# EasyEDA Pro project compSensorMB.eprj

# Schematic Schematic1
Create Date: 2024-01-20; Page Name: P1; Project Name: compSensorMB; Schematic Name: Schematic1; Update Date: 2024-04-05; Company: 嘉立创EDA; Page Size: A4; Version: V1.0
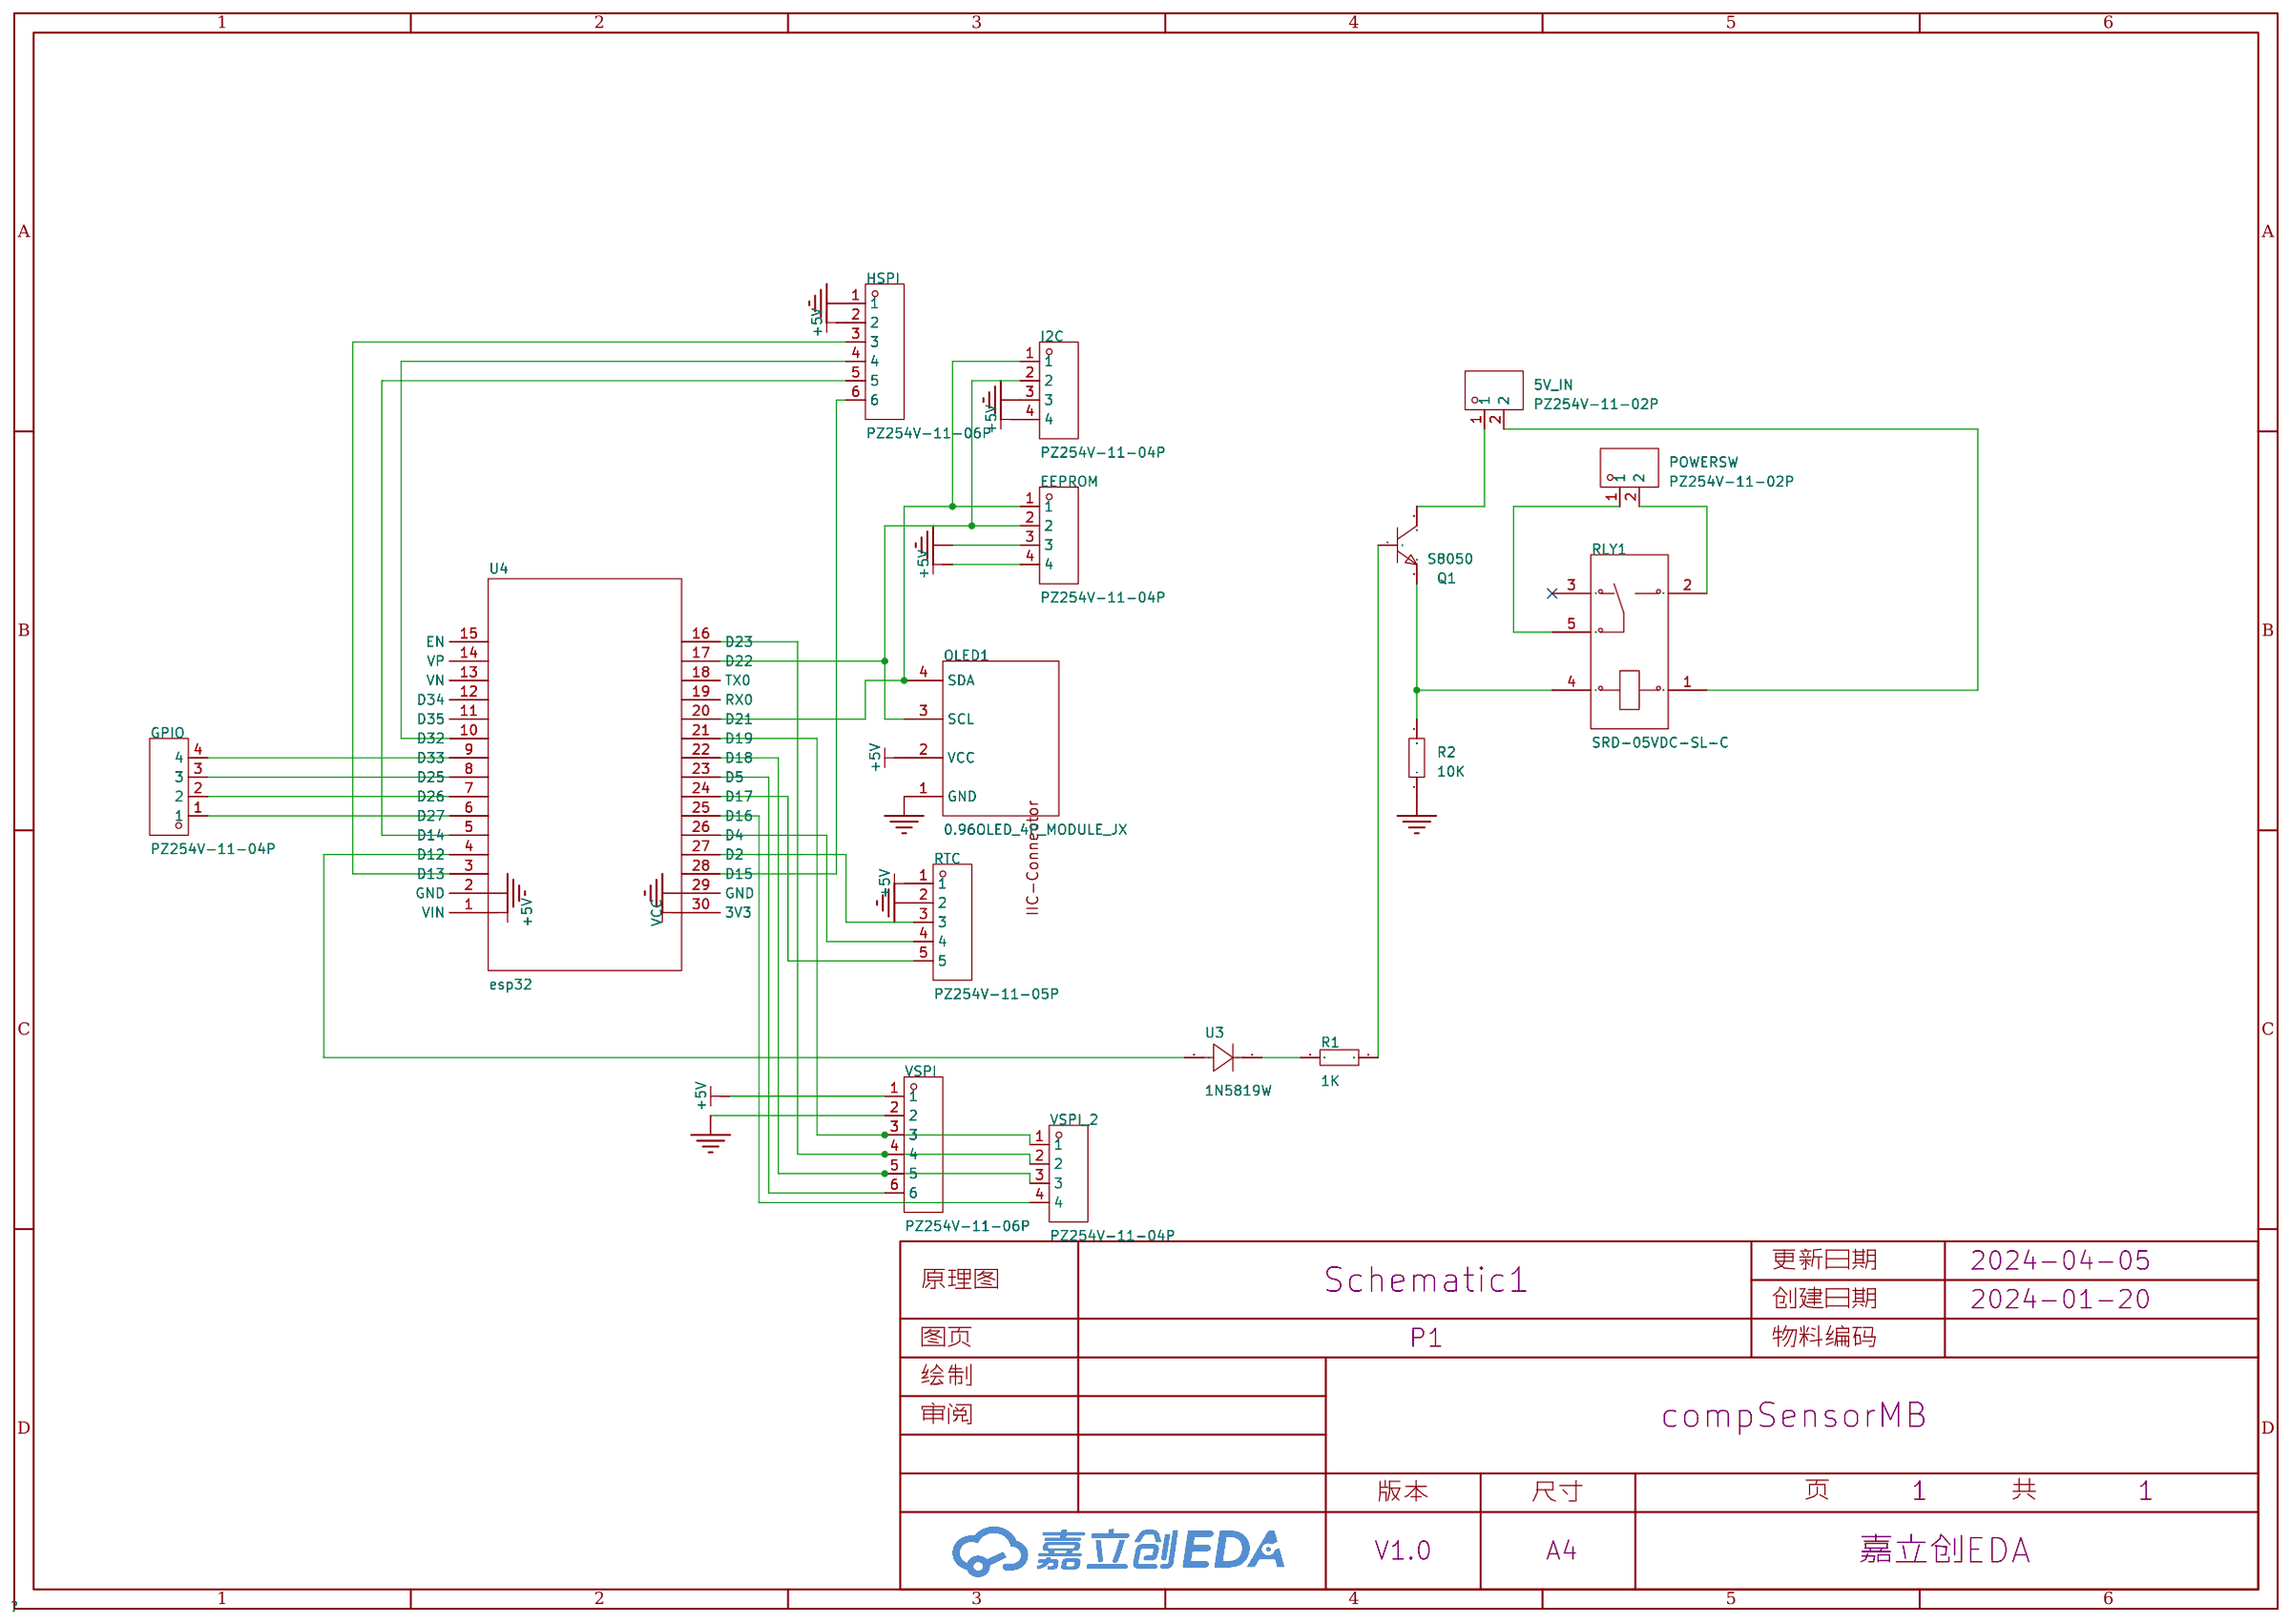
[diagram p0: schematic sheet]

## Parts
5V_IN  PZ254V-11-02P  [HDR-TH_2P-P2.54-V-M]
EEPROM  PZ254V-11-04P  [HDR-TH_4P-P2.54-V-M]
GPIO  PZ254V-11-04P  [HDR-TH_4P-P2.54-V-M]
HSPI  PZ254V-11-06P  [HDR-TH_6P-P2.54-V-M]
I2C  PZ254V-11-04P  [HDR-TH_4P-P2.54-V-M]
OLED1  0.96OLED_4P_MODULE_JX  [0.96OLED_4P]
POWERSW  PZ254V-11-02P  [HDR-TH_2P-P2.54-V-M]
Q1  S8050  [SOT-23-3_L2.9-W1.3-P1.90-LS2.4-BR]
R1  1K  [R0603]
R2  10K  [R0603]
RLY1  SRD-05VDC-SL-C  [RELAY-TH_SRD-XXVDC-XL-C]
RTC  PZ254V-11-05P  [HDR-TH_5P-P2.54-V-M]
U3  1N5819W  [SOD-123_L2.7-W1.6-LS3.7-R-RD]
U4  esp32  [esp32]
VSPI  PZ254V-11-06P  [HDR-TH_6P-P2.54-V-M]
VSPI_2  PZ254V-11-04P  [HDR-TH_4P-P2.54-V-M]

## Library data of the parts
5V_IN POWERSW = PZ254V-11-02P: 插针结构:1x2P;间距:2.54mm;行距:-;圆针/方针:方针;安装类型:直插;排数:单排;总PIN位数:2P;额定电流:-;额定电压:-;配合针长度:6mm;塑高:2.5mm;端接针长度:3mm;触头材质:黄铜;触头镀层:-;工作温度范围:-40℃~+105℃;颜色:黑色;; LCSC Part Name: 间距:2.54mm 1x2P 直插 方针; Supplier Part: C492401; Manufacturer: XFCN(兴飞); Supplier Footprint: 插件,P=2.54mm; JLCPCB Part Class: 扩展库; Datasheet: https://atta.szlcsc.com/upload/public/pdf/source/20200309/C492401_A812433581A9B211A7FFA413ADDFF0E5.pdf; Supplier: LCSC; Pin Structure: 1x2P; Pitch: 2.54mm; Circluar Pins/Square Pins: 方针; Mounting Type: 直插; Number of Rows: 单排; Number of Pins: 2P; Length of Mating Pin: 6mm; Insulation Height: 2.5mm; Length of End Connection Pin: 3mm; Contact Material: 黄铜; Operating Temperature Range: -40℃~+105℃; Color: 黑色
EEPROM GPIO I2C VSPI_2 = PZ254V-11-04P: 插针结构:1x4P;间距:2.54mm;行距:-;圆针/方针:方针;安装类型:直插;排数:单排;总PIN位数:4P;额定电流:3A;额定电压:250V;配合针长度:6mm;塑高:2.5mm;端接针长度:3mm;触头材质:-;工作温度范围:-40℃~+105℃;颜色:黑色;; LCSC Part Name: 间距:2.54mm 1x4P 直插 方针; Supplier Part: C2691448; Manufacturer: XFCN(兴飞); Supplier Footprint: 插件,P=2.54mm; JLCPCB Part Class: 扩展库; Datasheet: https://atta.szlcsc.com/upload/public/pdf/source/20200309/C492403_F9F19131791D08044AD4F84F8E751A34.pdf; Supplier: LCSC; Pin Structure: 1x4P; Pitch: 2.54mm; Circluar Pins/Square Pins: 方针; Mounting Type: 直插; Number of Rows: 单排; Number of Pins: 4P; Current Rating (Max): 3A; Voltage Rating (Max): 250V; Length of Mating Pin: 6mm; Insulation Height: 2.5mm; Length of End Connection Pin: 3mm; Operating Temperature Range: -40℃~+105℃; Color: 黑色
HSPI VSPI = PZ254V-11-06P: 插针结构:1x6P;间距:2.54mm;行距:-;圆针/方针:方针;安装类型:直插;排数:单排;总PIN位数:6P;额定电流:-;额定电压:-;配合针长度:6mm;塑高:2.5mm;端接针长度:3mm;触头材质:黄铜;触头镀层:-;工作温度范围:-40℃~+105℃;颜色:黑色;; LCSC Part Name: 间距:2.54mm 1x6P 直插 方针; Supplier Part: C492405; Manufacturer: XFCN(兴飞); Supplier Footprint: 插件,P=2.54mm; JLCPCB Part Class: 扩展库; Datasheet: https://atta.szlcsc.com/upload/public/pdf/source/20200309/C492405_597F1930F5B55CC3C7FD95458F1C3977.pdf; Supplier: LCSC; Pin Structure: 1x6P; Pitch: 2.54mm; Circluar Pins/Square Pins: 方针; Mounting Type: 直插; Number of Rows: 单排; Number of Pins: 6P; Length of Mating Pin: 6mm; Insulation Height: 2.5mm; Length of End Connection Pin: 3mm; Contact Material: 黄铜; Operating Temperature Range: -40℃~+105℃; Color: 黑色
OLED1 = 0.96OLED_4P_MODULE_JX: Supplier Part: C9900004566; Supplier Footprint: 插件; JLCPCB Part Class: 扩展库; Datasheet: https://atta.szlcsc.comnull; Supplier: LCSC
Q1 = S8050_C2891804: 晶体管类型:NPN;集电极电流(Ic):500mA;集射极击穿电压(Vceo):25V;功率(Pd):300mW;; LCSC Part Name: NPN 电流:500mA 耐压:25V; Supplier Part: C2891804; Manufacturer: YONGYUTAI(永裕泰); Supplier Footprint: SOT-23; JLCPCB Part Class: 扩展库; Datasheet: https://atta.szlcsc.com/upload/public/pdf/source/20210901/5347316A10609C628D4D69AE01446E5B.pdf; Supplier: LCSC; Transistor Type: NPN; Collector Current (Ic): 500mA; Collector-Emitter Breakdown Voltage (Vceo): 25V; Power Dissipation (Pd): 300mW; Collector Cut-Off Current (Icbo): 1uA; Collector-Emitter Saturation Voltage (VCE(sat)@Ic,Ib): 500mV@500mA,50mA
R1 R2 = Res_0603: Supplier Footprint: 0603
RLY1 = SRD-05VDC-SL-C: 线圈电压:5V;触点形式:一组转换:1C(单刀双掷-转换);触点容量(电阻负载):-;最大切换电压:250V@AC;最大切换电流:15A;; LCSC Part Name: 蓝色; Supplier Part: C35449; Manufacturer: 松乐; Supplier Footprint: 插件,15.6x19.2mm; JLCPCB Part Class: 扩展库; Datasheet: https://atta.szlcsc.com/upload/public/pdf/source/20200305/C490149_C96E4098A3B1FFB377D5AD2E40B7C2A8.pdf; Supplier: LCSC; Coil Voltage: 5V; Contact Form: 一组转换:1C(单刀双掷-转换); Pin Number: 5; Maximum Switching Voltage: 250V@AC; Coil Rated Power: 360mW; Maximum Switching Current: 15A; Coil Type: 无极性-单线圈; Coil Resistance: 70Ω; Contact Resistance: 100mΩ; Operate Time: 10ms; Release Time: 10ms
RTC = PZ254V-11-05P: 插针结构:1x5P;间距:2.54mm;行距:-;圆针/方针:方针;安装类型:直插;排数:单排;总PIN位数:5P;额定电流:-;额定电压:-;配合针长度:6mm;塑高:2.5mm;端接针长度:3mm;触头材质:黄铜;触头镀层:-;工作温度范围:-40℃~+105℃;颜色:黑色;; LCSC Part Name: 间距:2.54mm 1x5P 直插 方针; Supplier Part: C492404; Manufacturer: XFCN(兴飞); Supplier Footprint: 插件,P=2.54mm; JLCPCB Part Class: 扩展库; Datasheet: https://atta.szlcsc.com/upload/public/pdf/source/20200309/C492404_E51533260F8710EFF5D4617281164C1D.pdf; Supplier: LCSC; Pin Structure: 1x5P; Pitch: 2.54mm; Circluar Pins/Square Pins: 方针; Mounting Type: 直插; Number of Rows: 单排; Number of Pins: 5P; Length of Mating Pin: 6mm; Insulation Height: 2.5mm; Length of End Connection Pin: 3mm; Contact Material: 黄铜; Operating Temperature Range: -40℃~+105℃; Color: 黑色
U3 = 1N5819W_C963381: 二极管配置:独立式;正向压降(Vf):600mV@200mA;直流反向耐压(Vr):40V;平均整流电流(Io):350mA;; LCSC Part Name: 电压:40V 电流:350mA; Supplier Part: C963381; Manufacturer: JSMSEMI(杰盛微); Supplier Footprint: SOD-123; JLCPCB Part Class: Extended Part; Datasheet: https://atta.szlcsc.com/upload/public/pdf/source/20230807/ADD53622154D5B572F84A7B877E922CE.pdf; Supplier: LCSC; Diode Configuration: 独立式; Forward Voltage (Vf@If): 600mV@200mA; Reverse Voltage (Vr): 40V; Average Rectified Current (Io): 350mA; Reverse Leakage Current (Ir): 5uA@30V
U4 = esp32

## Nets
+5V: EEPROM.4 HSPI.2 I2C.4 OLED1.2(VCC) RTC.1 U4.1(VIN) VSPI.1
GND: EEPROM.3 HSPI.1 I2C.3 OLED1.1(GND) R2.1 RTC.2 U4.2(GND) U4.29(GND) VSPI.2
VCC: U4.30(3V3)
$1N11714: RTC.3 U4.27(D2)
$1N11719: RTC.4 U4.26(D4)
$1N11729: U3.2(A) U4.4(D12)
$1N11905: R1.1 U3.1(K)
$1N11908: Q1.1(B) R1.2
$1N12113: 5V_IN.2 RLY1.1
$1N12205: 5V_IN.1 Q1.3(C)
$1N13057: POWERSW.1 RLY1.5
$1N13067: POWERSW.2 RLY1.2
$1N13174: EEPROM.1 I2C.1 OLED1.4(SDA) U4.20(D21)
$1N13191: EEPROM.2 I2C.2 OLED1.3(SCL) U4.17(D22)
$1N13659: U4.23(D5) VSPI.6
$1N13778: RTC.5 U4.24(D17)
$1N17139: U4.22(D18) VSPI.5 VSPI_2.3
$1N17146: U4.16(D23) VSPI.4 VSPI_2.2
$1N17153: U4.21(D19) VSPI.3 VSPI_2.1
$1N17169: U4.25(D16) VSPI_2.4
$1N17247: HSPI.6 U4.28(D15)
$1N17252: HSPI.3 U4.3(D13)
$1N17257: HSPI.5 U4.5(D14)
$1N17294: HSPI.4 U4.10(D32)
$1N17359: GPIO.4 U4.9(D33)
$1N17362: GPIO.3 U4.8(D25)
$1N17365: GPIO.2 U4.7(D26)
$1N17368: GPIO.1 U4.6(D27)
$1N17907: Q1.2(E) R2.2 RLY1.4

Not connected (* = marked no-connect by the designer): RLY1 3*; U4 11(D35) 12(D34) 13(VN) 14(VP) 15(EN) 18(TX0) 19(RX0)

# Board PCB1
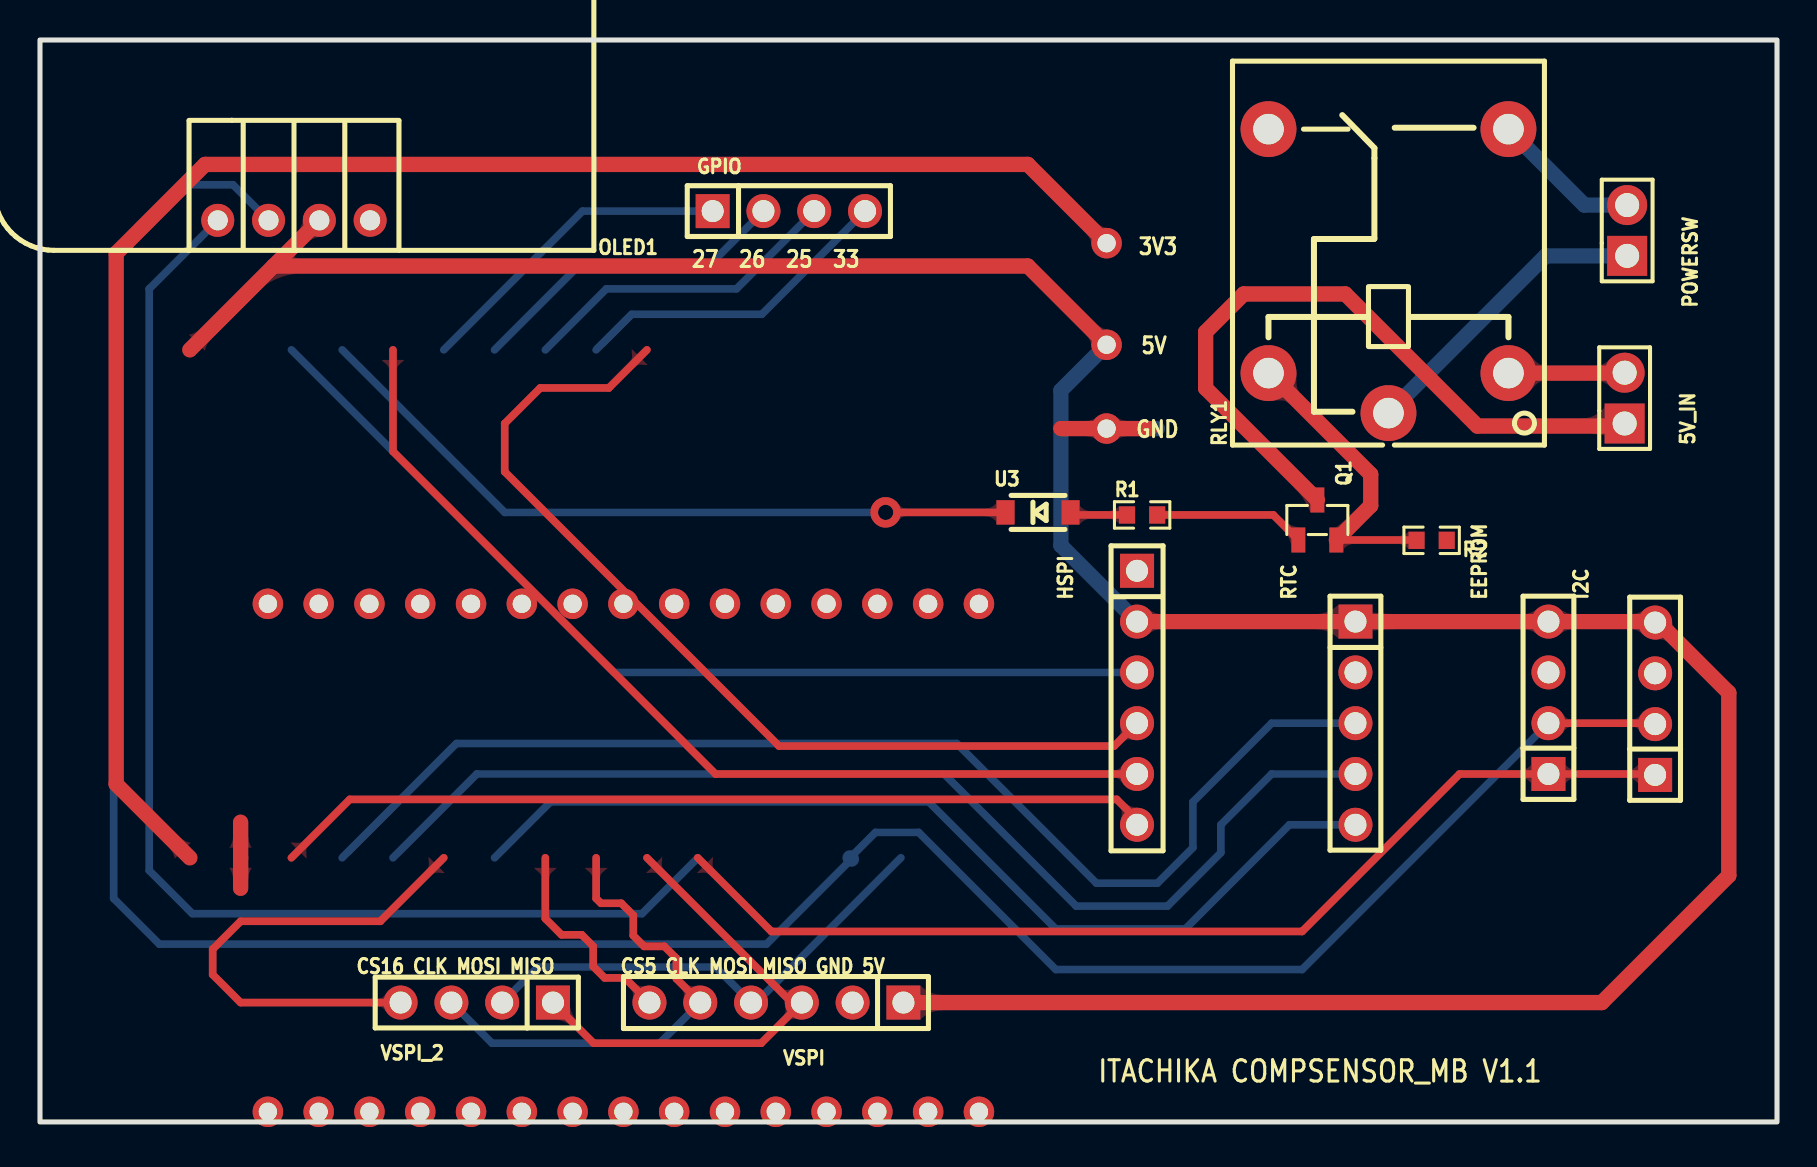
[diagram p1: board, top side]
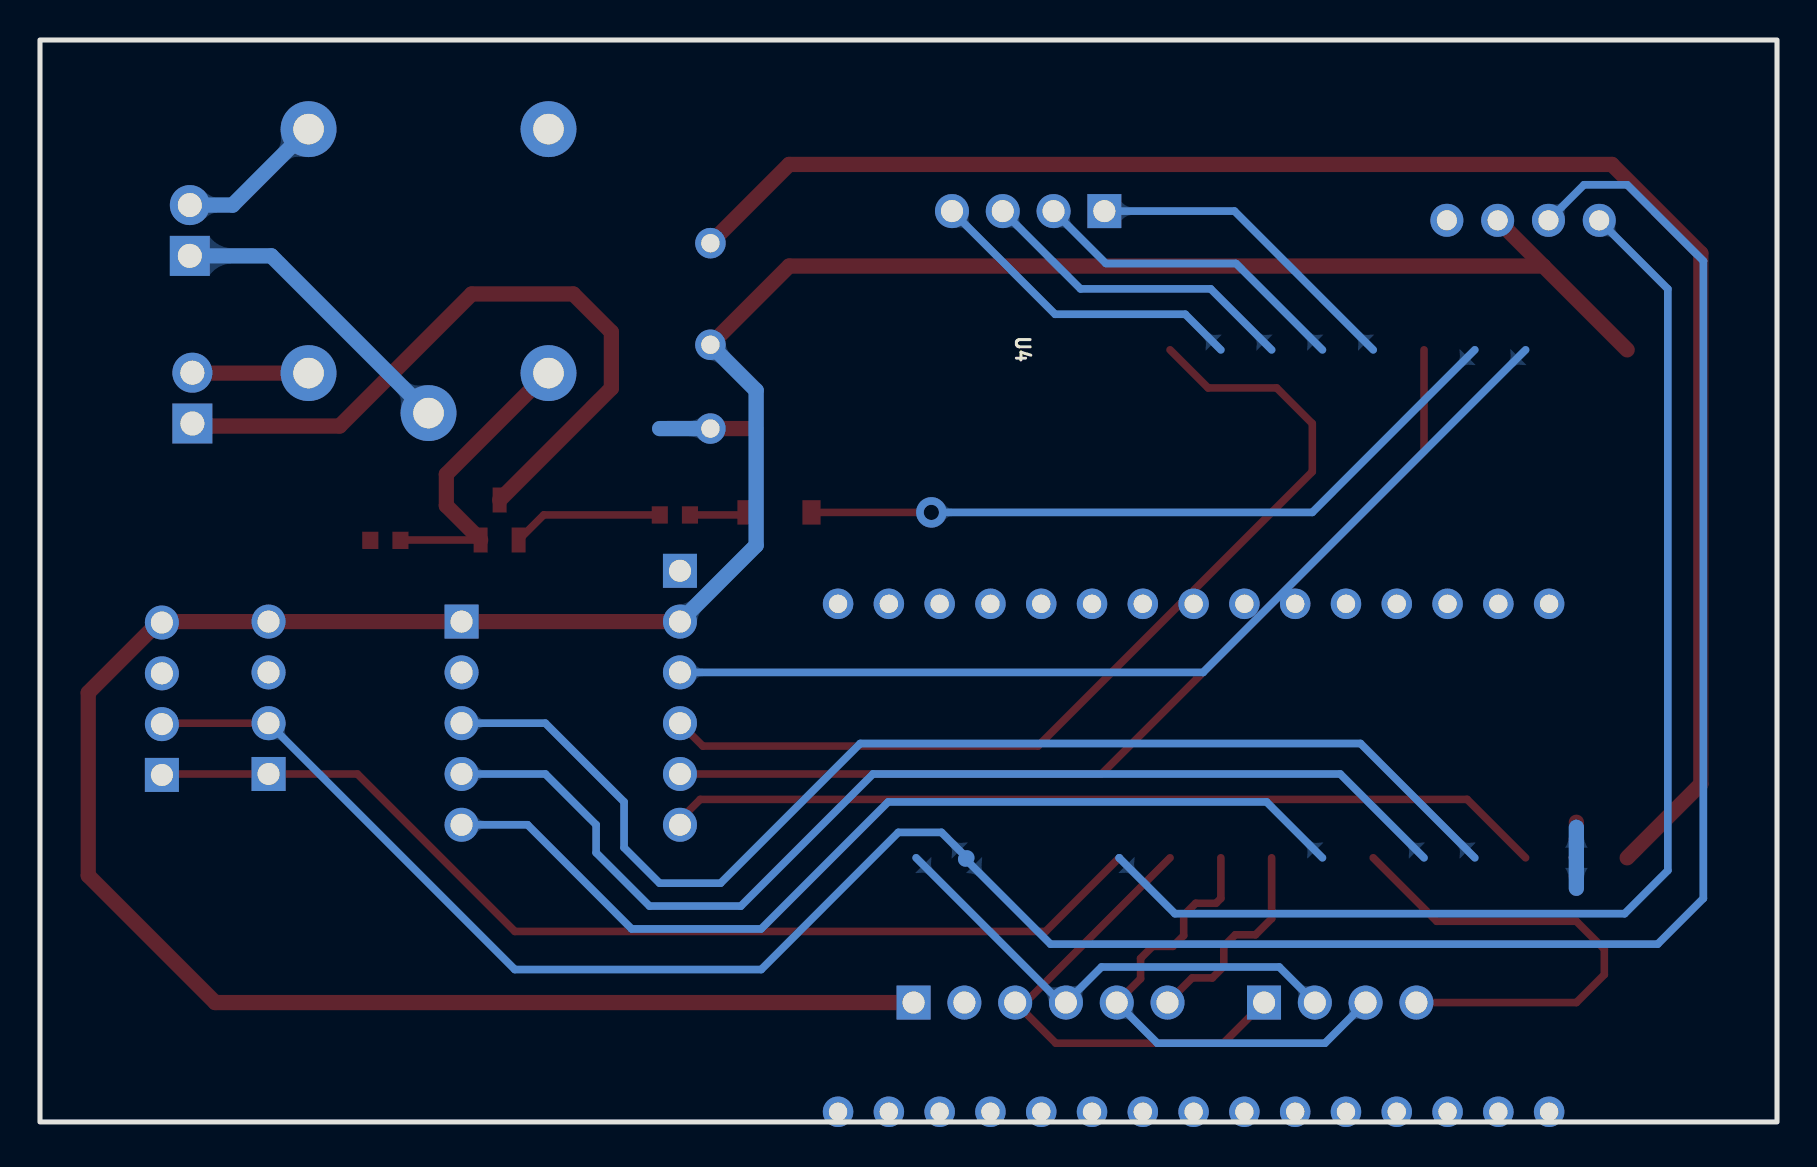
[diagram p2: board, bottom side, seen from below]

Outline 86.87 x 54.1 mm; copper layers: Top Layer, Bottom Layer. Coordinates in mm from the lower left corner of the outline.
Outline path: rectangle 0,54.1 86.87,0
Stack: Top Layer 0.035mm / Dielectric1 1.51mm FR4 er 4.5 / Bottom Layer 0.035mm

## Design rules (mm)
template: JLCPCB Capability(Two Layers Board)
spacing copperThickness1oz (default): track to track 0.102, other pairs 0.152 to 0.3
spacing copperThickness2oz: track to track 0.203, other pairs 0.152 to 0.3
track width copperThickness1oz (default): min 0.127, default 0.254, max 2.54
track width copperThickness2oz: min 0.203, default 0.254, max 2.54
differential pair differentialPair (default): width min 0.127, default 0.254, max 2.54; gap min 0.152, default 0.152
via viaSize (default): diameter min 0.5, default 0.61, max 10; hole min 0.3, default 0.305, max 6.3

## Placement (name value [footprint] x y rotation side)
5V_IN  PZ254V-11-02P  [HDR-TH_2P-P2.54-V-M]  79.25 36.2 90 top
EEPROM  PZ254V-11-04P  [HDR-TH_4P-P2.54-V-M]  75.44 21.21 90 top
GPIO  PZ254V-11-04P  [HDR-TH_4P-P2.54-V-M]  37.45 45.55 0 top
HSPI  PZ254V-11-06P  [HDR-TH_6P-P2.54-V-M]  54.86 21.21 270 top
I2C  PZ254V-11-04P  [HDR-TH_4P-P2.54-V-M]  80.77 21.16 90 top
NOREF  -  [Pad_e2943]  53.34 34.67 0 top
NOREF#2  -  [Pad_e12667]  53.34 43.94 0 top
NOREF#3  -  [Pad_e2942]  53.34 38.86 0 top
OLED1  0.96OLED_4P_MODULE_JX  [0.96OLED_4P]  12.7 45.09 180 top
POWERSW  PZ254V-11-02P  [HDR-TH_2P-P2.54-V-M]  79.38 44.58 90 top
Q1  S8050  [SOT-23-3_L2.9-W1.3-P1.90-LS2.4-BR]  63.88 30.1 270 top
R1  1K  [R0603]  55.12 30.35 0 top
R2  10K  [R0603]  69.6 29.08 180 top
RLY1  SRD-05VDC-SL-C  [RELAY-TH_SRD-XXVDC-XL-C]  67.44 42.55 90 top
RTC  PZ254V-11-05P  [HDR-TH_5P-P2.54-V-M]  65.79 19.94 270 top
U3  1N5819W  [SOD-123_L2.7-W1.6-LS3.7-R-RD]  49.91 30.48 0 top
U4  -  [esp32]  21.46 25.91 270 bottom
VSPI  PZ254V-11-06P  [HDR-TH_6P-P2.54-V-M]  36.83 5.97 180 top
VSPI_2  PZ254V-11-04P  [HDR-TH_4P-P2.54-V-M]  21.84 5.97 180 top

## Footprints (pads in the part's own frame, mm; a bottom-side part is the same pattern mirrored in y, then rotated)
0.96OLED_4P
  round 1.65 hole 1: 1(-3.81,-0.002) 2(-1.27,0.002) 3(1.27,0.002) 4(3.81,0.002)
esp32
  round 1.524 hole 0.914: 1(0,10.066) 2(0,7.527) 3(0,4.987) 4(0,2.446) 5(0,-0.093) 6(0,-2.634) 7(0,-5.173) 8(0,-7.713) 9(0,-10.254) 10(0,-12.793) 11(0,-15.334) 12(0,-17.873) 13(0,-20.413) 14(0,-22.953) 15(0,-25.494) 16(25.4,-25.494) 17(25.4,-22.953) 18(25.4,-20.413) 19(25.4,-17.873) 20(25.4,-15.334) 21(25.4,-12.793) 22(25.4,-10.254) 23(25.4,-7.713) 24(25.4,-5.173) 25(25.4,-2.634) 26(25.4,-0.093) 27(25.4,2.446) 28(25.4,4.987) 29(25.4,7.527) 30(25.4,10.066)
HDR-TH_2P-P2.54-V-M
  rect 2x2 hole 1.2: 1(-1.27,0)
  round 2 hole 1.2: 2(1.27,0)
HDR-TH_4P-P2.54-V-M
  rect 1.7x1.7 hole 1.1: 1(-3.81,0)
  round 1.7 hole 1.1: 2(-1.27,0) 3(1.27,0) 4(3.81,0)
HDR-TH_5P-P2.54-V-M
  rect 1.7x1.7 hole 1.1: 1(-5.08,0)
  round 1.7 hole 1.1: 2(-2.54,0) 3(0,0) 4(2.54,0) 5(5.08,0)
HDR-TH_6P-P2.54-V-M
  rect 1.7x1.7 hole 1.1: 1(-6.35,0)
  round 1.7 hole 1.1: 2(-3.81,0) 3(-1.27,0) 4(1.27,0) 5(3.81,0) 6(6.35,0)
Pad_e2942
  round 1.524 hole 0.914: 1(0,0)
Pad_e2943
  round 1.524 hole 0.914: 2(0,0)
Pad_e12667
  round 1.524 hole 0.914: 31(0,0)
R0603
  rect 0.806x0.864 smd: 1(-0.753,0) 2(0.753,0)
RELAY-TH_SRD-XXVDC-XL-C
  round 2.794 hole 1.524: 1(-5.1,-6) 2(7.1,-6) 3(7.1,6) 4(-5.1,6) 5(-7.1,0)
SOD-123_L2.7-W1.6-LS3.7-R-RD
  rect 0.909x1.219 smd: 1(1.625,0) 2(-1.625,0)
SOT-23-3_L2.9-W1.3-P1.90-LS2.4-BR
  rect 1.25x0.7 smd: 1(1,-0.95) 2(1,0.95) 3(-1,0)

## Nets
As in the schematic, except:
+5V: EEPROM.4 HSPI.2 I2C.4 NOREF#3.1 OLED1.2 RTC.1 U4.1 VSPI.1
GND: EEPROM.3 HSPI.1 I2C.3 NOREF.2 OLED1.1 R2.1 RTC.2 U4.2 U4.29 VSPI.2
VCC: NOREF#2.31 U4.30

Pads without a net: RLY1 3; U4 11 12 13 14 15 18 19

## Via types
v1: diameter 1.524, hole 0.762, Top Layer to Bottom Layer, 1 via

## Routing (per net, layer and track width the routed paths; a pad name or vN(x,y) marks a point on that pad's centre or on a via; arc(x,y) is an arc through that point)
+5V: length 152.9
  Top Layer w0.762: 11.68,42.8 OLED1.2 ; 11.68,42.8 7.49,38.61 ; 11.68,42.8 49.4,42.8 NOREF#3.1 ; 54.93,24.83 55.12,25.02 RTC.1 80.9,25.02 84.45,21.46 84.45,12.32 78.1,5.97 43.18,5.97
  Bottom Layer w0.762: NOREF#3.1 51.05,36.58 51.05,28.83 HSPI.2
GND: length 13.3
  Top Layer w0.762: 55.5,34.67 NOREF.2 51.05,34.67 ; 10.03,11.68 10.03,14.99
  Bottom Layer w0.762: 10.03,14.73 10.03,11.68 ; NOREF.2 55.88,34.67
VCC: length 84.8
  Top Layer w0.762: 7.49,13.21 3.81,16.89 3.81,43.43 8.25,47.88 49.4,47.88 NOREF#2.31
$1N11714: length 60.6
  Bottom Layer w0.381: 15.11,13.21 20.83,18.92 45.85,18.92 52.83,11.94 55.88,11.94 57.66,13.72 57.66,16 61.59,19.94 RTC.3
$1N11719: length 56.2
  Bottom Layer w0.381: RTC.4 61.59,17.4 59.06,14.86 59.06,13.46 56.39,10.8 51.82,10.8 45.21,17.4 21.84,17.4 17.65,13.21
$1N11729: length 36.5
  Top Layer w0.381: v1(42.29,30.48) U3.2
  Bottom Layer w0.381: v1(42.29,30.48) 23.24,30.48 15.11,38.61
$1N11905: length 2.8
  Top Layer w0.381: 51.54,30.35 R1.1
$1N11908: length 7.6
  Top Layer w0.381: Q1.1 61.68,30.35 R1.2
$1N12113: length 5.8
  Top Layer w0.762: 5V_IN.2 79.23,37.45 RLY1.1
$1N12205: length 35.2
  Top Layer w0.762: 5V_IN.1 79.12,34.8 71.88,34.8 65.28,41.4 60.2,41.4 58.29,39.5 58.29,36.69 Q1.3
$1N13057: length 15.2
  Bottom Layer w0.762: RLY1.5 75.3,43.31 POWERSW.1
$1N13067: length 7.5
  Bottom Layer w0.762: RLY1.2 77.23,45.85 POWERSW.2
$1N13174: length 115.7
  Top Layer w0.381: 80.39,17.35 80.34,17.4 70.99,17.4 63.12,9.53 36.58,9.53 32.89,13.21
  Bottom Layer w0.381: OLED1.4 5.46,41.65 5.46,12.57 7.62,10.41 30.11,10.41 32.89,13.2 32.89,13.21
$1N13191: length 130.8
  Top Layer w0.381: 80.39,19.89 80.34,19.94 EEPROM.2 74.8,19.94 ; 80.34,19.81 80.39,19.77
  Bottom Layer w0.381: OLED1.3 9.65,46.86 7.49,46.86 3.68,43.05 3.68,11.18 5.97,8.89 36.33,8.89 40.58,13.14 40.65,13.21 ; EEPROM.2 63.12,7.62 50.8,7.62 43.94,14.48 41.78,14.48 40.51,13.21
  Bottom Layer w0.762: 40.51,13.21 40.58,13.14
$1N13659: length 10.6
  Top Layer w0.381: VSPI.6 29.25,7.2 28.24,7.2 27.66,7.77 27.66,8.78 27.09,9.36 26.08,9.36 25.27,10.17 25.27,13.21
$1N13778: length 49
  Bottom Layer w0.381: RTC.5 62.48,14.86 57.28,9.65 50.8,9.65 44.45,16 25.53,16 22.73,13.21
$1N17139: length 24.7
  Top Layer w0.381: VSPI.5 31.83,7.16 31.83,8.18 31.23,8.78 30.21,8.78 29.67,9.32 29.67,10.33 29.07,10.93 28.06,10.93 27.81,11.18 27.81,13.21
  Bottom Layer w0.381: VSPI.5 30.99,3.94 22.61,3.94 VSPI_2.3
$1N17146: length 24.4
  Bottom Layer w0.381: 43.05,13.21 35.81,5.97 35.56,5.97 33.78,7.75 24.89,7.75 VSPI_2.2
$1N17153: length 24.9
  Top Layer w0.381: 30.35,13.21 37.59,5.97 VSPI.3 36.07,3.94 27.69,3.94 VSPI_2.1
$1N17169: length 24.7
  Top Layer w0.381: 20.19,13.21 17.02,10.03 10.03,10.03 8.64,8.64 8.64,7.37 10.03,5.97 VSPI_2.4
$1N17247: length 44.3
  Top Layer w0.381: 55.12,14.86 53.85,16.13 15.49,16.13 12.57,13.21
$1N17252: length 49
  Bottom Layer w0.381: HSPI.3 28.7,22.48 12.57,38.61
$1N17257: length 49
  Top Layer w0.381: HSPI.5 33.78,17.4 17.65,33.53 17.65,38.61
$1N17294: length 48.8
  Top Layer w0.381: HSPI.4 53.72,18.8 36.96,18.8 23.24,32.51 23.24,34.93 25.02,36.7 28.45,36.7 30.35,38.61
$1N17359: length 16.3
  Bottom Layer w0.381: GPIO.4 36.1,40.39 29.59,40.39 27.81,38.61
$1N17362: length 16.3
  Bottom Layer w0.381: GPIO.3 34.83,41.66 28.32,41.66 25.27,38.61
$1N17365: length 16.3
  Bottom Layer w0.381: 36.18,45.55 33.56,42.93 27.05,42.93 22.73,38.61
$1N17368: length 16.3
  Bottom Layer w0.381: 20.19,38.61 27.13,45.55 GPIO.1
$1N17907: length 15.2
  Top Layer w0.381: R2.2 68.83,29.1 Q1.2
  Top Layer w0.762: RLY1.4 61.49,37.45 66.55,32.39 66.55,30.82 Q1.2

## Copper pours and planes (outline as drawn; the poured copper is in the pictures)
GND on Top Layer: 0,53.72 86.61,53.72 86.61,-0.03 0,-0.03
GND on Bottom Layer: 0.13,53.98 86.74,53.98 86.74,-0.28 0.13,-0.28

Small or netless copper shapes (teardrops, artwork), in the pictures only: 56 on Top Layer, 39 on Bottom Layer

## Text on the board
Top Silkscreen Layer: CS16 CLK MOSI MISO | CS5 CLK MOSI MISO GND 5V | 27  26  25  33 | GND | 3V3 | 5V | ITACHIKA COMPSENSOR_MB V1.1
